# Altium project SDR_PMR.PrjPcb (part 7 of 12)
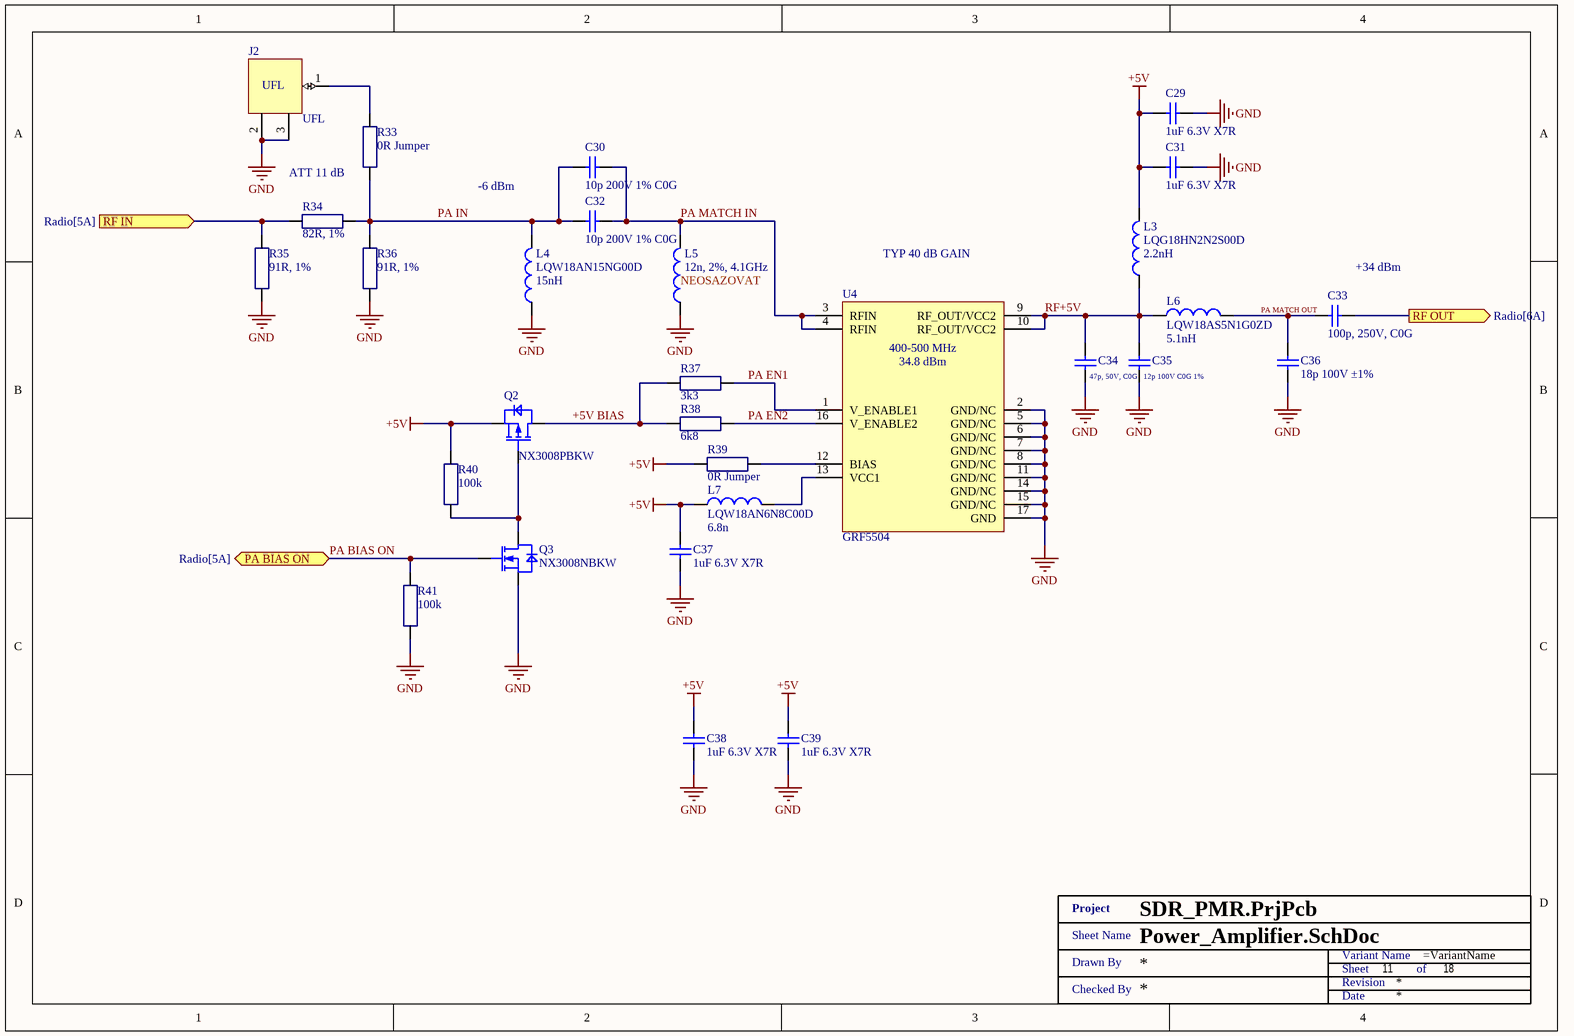
[diagram p18: Power_Amplifier.SchDoc]

## Sheet Power_Amplifier.SchDoc (continued)
### Library data of the parts
C29 C31 C37-C39 = TCC0402X7R105K6R3AT: Capacitor: MLCC; SMD; 0402; 1µF; 6.3V; ±10%; X7R; CCTC; Capacitance: 1u; Supplier 1: LCSC; Supplier Part Number 1: C5448871; Manufacturer: CCTC; Manufacturer Part Number: TCC0402X7R105K6R3AT; Category: Ceramic Capacitors; Stock 1: 242350; Pricing 1: 50=0.0089, 500=0.0072, 1500=0.0063, 10000=0.0058, 20000=0.0053, 50000=0.005 (USD); ComponentLink1URL: https://datasheet.octopart.com:443/TCC0402X7R105K6R3AT-CCTC-datasheet-194166649.pdf?src-supplier=LCSC; ComponentLink1Description: https://datasheet.octopart.com:443/TCC0402X7R105K6R3AT-CCTC-datasheet-194166649.pdf?src-supplier=LCSC; ComponentLink2URL: https://datasheet.octopart.com:443/TCC0402X7R105K6R3AT-CCTC-datasheet-192317456.pdf?src-supplier=HQonline; ComponentLink2Description: https://datasheet.octopart.com:443/TCC0402X7R105K6R3AT-CCTC-datasheet-192317456.pdf?src-supplier=HQonline
C30 C32 = 06032U100FAT2A: Cap Ceramic 10pF 200V C0G 1% Pad SMD 0603 125°C Ultra Low ESR T/R; Manufacturer: Kyocera AVX; Supplier 1: Mouser; Supplier Part Number 1: 581-06032U100FAT2A; Manufacturer Part Number: 06032U100FAT2A; RoHS: Yes; Category: Ceramic Capacitors; Stock 1: 12241; Pricing 1: 1=0.33, 10=0.227, 50=0.227, 100=0.137, 1000=0.087, 10000=0.07 (USD); ComponentLink1URL: https://datasheet.ciiva.com/219/useries-219573.pdf?src-supplier=Digi-Key; ComponentLink1Description: https://datasheet.ciiva.com/219/useries-219573.pdf?src-supplier=Digi-Key; ComponentLink2URL: https://datasheet.ciiva.com/16209/useries-16209209.pdf?src-supplier=Future+Electronics; ComponentLink2Description: https://datasheet.ciiva.com/16209/useries-16209209.pdf?src-supplier=Future+Electronics; Supplier 2: Arrow Electronics; Supplier Part Number 2: 06032U100FAT2A; Supplier 3: Newark; Supplier Part Number 3: 96Y8278; Capacitance: 10p
C33 = 885342006003: CAP CER 100PF 250V C0G/NP0 0603; Manufacturer: Wurth Electronics Inc.; Tolerance: ±5%; Temperature Coefficient: C0G, NP0; Notification: Current market demand for these product types have resulted in fluctuating and extending lead times. Lead times may differ.; Supplier 1: Digi-Key; Supplier Part Number 1: 732-12167-1-ND; Manufacturer Part Number: 885342006003; RoHS: RoHS Compliant; Category: Capacitors; Stock 1: 43; Pricing 1: 1=0.1, 10=0.043, 100=0.0385, 500=0.03406 (USD); Packaging: Cut Tape (CT); Part Status: Active; Voltage - Rated: 250V; Operating Temperature: -55°C ~ 125°C; Features: -; Ratings: -; Applications: General Purpose; Failure Rate: -; Mounting Type: Surface Mount, MLCC; Package / Case: 0603 (1608 Metric); Size / Dimension: 0.063" L x 0.031" W (1.60mm x 0.80mm); Height - Seated (Max): -; Thickness (Max): 0.034" (0.87mm); Lead Spacing: -; Lead Style: -; ComponentLink1URL: https://katalog.we-online.de/pbs/datasheet/885342006003.pdf; ComponentLink1Description: https://katalog.we-online.de/pbs/datasheet/885342006003.pdf; Supplier 2: Farnell; Supplier Part Number 2: 2812519; Supplier 3: Mouser; Supplier Part Number 3: 710-885342006003; Capacitance: 100p
C34 = C0603C470J5GACAUTO: CAP CER 47PF 50V C0G/NP0 0603; Manufacturer: KEMET; Tolerance: ±5%; Temperature Coefficient: C0G, NP0; Manufacturer Part Number: C0603C470J5GACAUTO; RoHS: RoHS Compliant; Category: Capacitors; Stock 1: 21519; Pricing 1: 1=0.12, 10=0.088, 100=0.0391, 500=0.02792, 1000=0.02193 (USD); Packaging: Cut Tape (CT); Part Status: Active; Voltage - Rated: 50V; Operating Temperature: -55°C ~ 125°C; Features: -; Ratings: AEC-Q200; Applications: Automotive; Failure Rate: -; Mounting Type: Surface Mount, MLCC; Package / Case: 0603 (1608 Metric); Size / Dimension: 0.063" L x 0.032" W (1.60mm x 0.80mm); Height - Seated (Max): -; Thickness (Max): 0.034" (0.87mm); Lead Spacing: -; Lead Style: -; ComponentLink1URL: https://search.kemet.com/component-edge/download/datasheet/C0603C470J5GACAUTO.pdf; ComponentLink1Description: https://search.kemet.com/component-edge/download/datasheet/C0603C470J5GACAUTO.pdf; Capacitance: 47p; Supplier 1: Mouser; Supplier Part Number 1: 80-C0603C470J5G; Supplier 2: Farnell; Supplier Part Number 2: 1414639; Supplier 3: Digi-Key; Supplier Part Number 3: 399-6890-1-ND; Supplier 4: TME; Supplier Part Number 4: C0603C470J5GAC
C35 = 06031U120FAT2A: Cap Ceramic 12pF 100V C0G 1% SMD 0603 125°C T/R; Manufacturer: Kyocera AVX; Supplier 1: Mouser; Supplier Part Number 1: 581-06031U120FAT2A; Manufacturer Part Number: 06031U120FAT2A; RoHS: Yes; Category: Ceramic Capacitors; Stock 1: 6418; Pricing 1: 1=0.33, 10=0.227, 50=0.227, 100=0.137, 1000=0.087, 10000=0.07 (USD); Mounting Technology: Surface Mount; Case/Package: 0603; Case Code (Metric): 1608; Case Code (Imperial): 0603; Min Operating Temperature: -55°C; Max Operating Temperature: 125°C; Packaging: Tape and Reel; Capacitance: 12p; Tolerance: 1%; Package Quantity: 4000; Voltage Rating: 100V; Voltage Rating (DC): 100V; Dielectric: C0G; Termination: SMD/SMT; Series: U; Construction: Flat; Length: 1.6mm; Width: 0.81mm; Depth: 0.76mm; Radiation Hardening: No; RoHS Compliant: Yes; ComponentLink1URL: https://datasheet.ciiva.com/208/useries-208490.pdf?src-supplier=Digi-Key; ComponentLink1Description: https://datasheet.ciiva.com/208/useries-208490.pdf?src-supplier=Digi-Key
C36 = 06031U180FAT2A: 0603 18 pF 100 V ±1 % Tolerance C0G/NP0 SMT Multilayer Ceramic Capacitor; Manufacturer: Kyocera AVX; Supplier 1: Mouser; Supplier Part Number 1: 581-06031U180FAT2A; Manufacturer Part Number: 06031U180FAT2A; RoHS: Yes; Category: Ceramic Capacitors; Stock 1: 3660; Pricing 1: 1=0.33, 10=0.227, 50=0.227, 100=0.137, 1000=0.087, 10000=0.07 (USD); ComponentLink1URL: https://datasheet.ciiva.com/11547/useries-11547573.pdf?src-supplier=Avnet; ComponentLink1Description: https://datasheet.ciiva.com/11547/useries-11547573.pdf?src-supplier=Avnet; ComponentLink2URL: https://datasheet.ciiva.com/208/useries-208495.pdf?src-supplier=Digi-Key; ComponentLink2Description: https://datasheet.ciiva.com/208/useries-208495.pdf?src-supplier=Digi-Key; Capacitance: 18p
J2 = CONUFL001-SMD-T: CONN UMC JACK STR SMD; Manufacturer: Linx Technologies Inc.; Connector Style: Ultra Miniature Coaxial; Connector Type: Jack, Male Pin; Supplier 1: Digi-Key; Supplier Part Number 1: CONUFL001-SMD-TCT-ND; Manufacturer Part Number: CONUFL001-SMD-T; RoHS: RoHS Compliant; Category: Connectors, Interconnects; Stock 1: 6423; Pricing 1: 1=0.97, 25=0.882, 100=0.826, 1000=0.742, 2500=0.63 (USD); Packaging: Cut Tape (CT); Part Status: Active; Contact Termination: -; Shield Termination: -; Impedance: -; Mounting Type: Surface Mount; Mounting Feature: -; Cable Group: -; Fastening Type: Snap-On; Features: -; Housing Color: -; Ingress Protection: -; Includes: -; Body Material: -; Body Finish: -; Center Contact Plating: -; Dielectric Material: -; Operating Temperature: -; Center Contact Material: -; Mating Cycles: -; Insertion Loss: -; ComponentLink1URL: http://media.digikey.com/pdf/Data%20Sheets/Linx%20Technologies%20PDFs/CONUFL001-SMD_T_Dwg_RevB_5-15-17.pdf; ComponentLink1Description: http://media.digikey.com/pdf/Data%20Sheets/Linx%20Technologies%20PDFs/CONUFL001-SMD_T_Dwg_RevB_5-15-17.pdf; Supplier 2: Mouser; Supplier Part Number 2: 712-CONUFL001-SMD-T
L3 = LQG18HN2N2S00D: Inductor RF Chip Multi-Layer 2.2nH 0.3nH 100MHz 12Q-Factor Air 500mA 100mOhm DCR 0603 Paper T/R; Manufacturer: Murata; Manufacturer Lifecycle Status: IN PRODUCTION; Current Rating: 1.1A; DC Resistance (DCR): 100mΩ; Number of Circuits: 1; Q Factor: 12; Self Resonant Frequency: 6GHz; Shielding: Unshielded; Tolerance: 13.6364%; Manufacturer Part Number: LQG18HN2N2S00D; RoHS: Compliant; Category: Fixed Inductors; Stock 1: 71049; Pricing 1: 1=0.16, 10=0.133, 50=0.133, 100=0.11, 1000=0.09, 10000=0.068 (USD); Case/Package: 0603; Case Code (Imperial): 0603; Case Code (Metric): 1608; Core Material: Air; Country of Origin: Japan; DC Current: 500mA; Depth: 950µm; Export Control Classification Number (ECCN) Code: EAR99; Height: 800µm; Height - Seated (Max): 939.8µm; Harmonized Tariff Schedule (HTS) Code: 8504.50.80.00; Introduction Date: 2002-01-01; Lead Free: Lead Free; Length: 1.6mm; Lifecycle Status: Production; Max Current Rating: 1.1A; Max DC Current: 500mA; Max Operating Temperature: 85°C; Military Standard: Not; Min Operating Temperature: -40°C; Mounting Technology: Surface Mount; Pins: 2; Number of Terminals: 2; Radiation Hardening: No; REACH SVHC: Yes; RMS Current (Irms): 1.1A; Schedule B: 8504500000, 8504500000|8504500000|8504500000|8504500000|8504500000; ESR: 100mΩ; Termination: SMD/SMT; Test Frequency: 100MHz; Width: 800µm; ComponentLink1URL: https://datasheet.octopart.com:443/LQG18HN2N2S00D-Murata-datasheet-10063984.pdf?src-supplier=_legacy+Avnet; ComponentLink1Description: https://datasheet.octopart.com:443/LQG18HN2N2S00D-Murata-datasheet-10063984.pdf?src-supplier=_legacy+Avnet; ComponentLink2URL: https://datasheet.octopart.com:443/LQG18HN2N2S00D-Murata-datasheet-519214.pdf?src-supplier=_legacy+Avnet; ComponentLink2Description: https://datasheet.octopart.com:443/LQG18HN2N2S00D-Murata-datasheet-519214.pdf?src-supplier=_legacy+Avnet; ComponentLink3URL: https://datasheet.octopart.com:443/LQG18HN2N2S00D-Murata-datasheet-5315143.pdf?src-supplier=element14+APAC; ComponentLink3Description: https://datasheet.octopart.com:443/LQG18HN2N2S00D-Murata-datasheet-5315143.pdf?src-supplier=element14+APAC; ComponentLink4URL: https://datasheet.octopart.com:443/LQG18HN2N2S00D-Murata-datasheet-14393368.pdf?src-supplier=Future+Electronics; ComponentLink4Description: https://datasheet.octopart.com:443/LQG18HN2N2S00D-Murata-datasheet-14393368.pdf?src-supplier=Future+Electronics; ComponentLink5URL: https://datasheet.octopart.com:443/LQG18HN2N2S00D-Murata-datasheet-166148639.pdf?src-supplier=TME; ComponentLink5Description: https://datasheet.octopart.com:443/LQG18HN2N2S00D-Murata-datasheet-166148639.pdf?src-supplier=TME; ComponentLink6URL: https://datasheet.octopart.com:443/LQG18HN2N2S00D-Murata-datasheet-140712951.pdf?src-supplier=Ciiva; ComponentLink6Description: https://datasheet.octopart.com:443/LQG18HN2N2S00D-Murata-datasheet-140712951.pdf?src-supplier=Ciiva; ComponentLink7URL: https://datasheet.octopart.com:443/LQG18HN2N2S00D-Murata-datasheet-138754083.pdf?src-supplier=Ciiva; ComponentLink7Description: https://datasheet.octopart.com:443/LQG18HN2N2S00D-Murata-datasheet-138754083.pdf?src-supplier=Ciiva; ComponentLink8URL: https://datasheet.octopart.com:443/LQG18HN2N2S00D-Murata-datasheet-140568993.pdf?src-supplier=Arrow.cn; ComponentLink8Description: https://datasheet.octopart.com:443/LQG18HN2N2S00D-Murata-datasheet-140568993.pdf?src-supplier=Arrow.cn; ComponentLink9URL: https://datasheet.octopart.com:443/LQG18HN2N2S00D-Murata-datasheet-145449721.pdf?src-supplier=Geoflip; ComponentLink9Description: https://datasheet.octopart.com:443/LQG18HN2N2S00D-Murata-datasheet-145449721.pdf?src-supplier=Geoflip; ComponentLink10URL: https://datasheet.octopart.com:443/LQG18HN2N2S00D-Murata-datasheet-8815610.pdf?src-supplier=Jameco+(USA); ComponentLink10Description: https://datasheet.octopart.com:443/LQG18HN2N2S00D-Murata-datasheet-8815610.pdf?src-supplier=Jameco+(USA); ComponentLink11URL: https://datasheet.octopart.com:443/LQG18HN2N2S00D-Murata-datasheet-331.pdf?src-supplier=DigiKey; ComponentLink11Description: https://datasheet.octopart.com:443/LQG18HN2N2S00D-Murata-datasheet-331.pdf?src-supplier=DigiKey; ComponentLink12URL: http://sigma.octopart.com:80/reach_statement/Murata-company-16.pdf?src-supplier=Compliance+Statements; ComponentLink12Description: http://sigma.octopart.com:80/reach_statement/Murata-company-16.pdf?src-supplier=Compliance+Statements; Supplier 1: Mouser; Supplier Part Number 1: 81-LQG11A2N2S00; Supplier 2: LCSC; Supplier Part Number 2: C113061
L4 = LQW18AN15NG00D: Inductor RF Chip Wirewound 15nH 2% 100MHz 40Q-Factor 600mA 130mOhm DCR 0603 Paper T/R; Manufacturer: Murata; Manufacturer Lifecycle Status: IN PRODUCTION; Core Material: Air; Current: 440mA; DC Resistance (DCR): 130mΩ; Number of Circuits: 1; Q Factor: 40; Self Resonant Frequency: 6GHz; Shielding: Unshielded; Test Frequency: 250MHz; Manufacturer Part Number: LQW18AN15NG00D; RoHS: Compliant; Category: Fixed Inductors; Pricing 1: 1=0.14, 10=0.126, 50=0.116, 100=0.092, 1000=0.072, 10000=0.052 (USD); Case/Package: 0603; Case Code (Imperial): 0603; Case Code (Metric): 1608; Composition: Wirewound; Country of Origin: Japan; Current Rating: 600mA; DC Current: 600mA; Depth: 1mm; Export Control Classification Number (ECCN) Code: EAR99; Height: 800µm; Harmonized Tariff Schedule (HTS) Code: 8504.50.80.00; Inductance Tolerance: 2%; Introduction Date: 2002-03-28; Lead Free: Lead Free; Length: 1.6mm; Lifecycle Status: Production; Max Current Rating: 600mA; Max DC Current: 600mA; Max Operating Temperature: 125°C; Military Standard: Not; Min Operating Temperature: -55°C; Mounting Technology: Surface Mount; Pins: 2; Number of Terminals: 2; Packaging: Cut Tape; Radiation Hardening: No; REACH SVHC: Yes; RMS Current (Irms): 600mA; Schedule B: 8504500000, 8504500000|8504500000|8504500000|8504500000|8504500000; ESR: 130mΩ; Termination: SMD/SMT; Tolerance: 2%; Weight: 3.005049mg; Width: 800µm; ComponentLink1URL: https://datasheet.octopart.com:443/LQW18AN15NG00D-Murata-datasheet-11553032.pdf?src-supplier=element14+APAC; ComponentLink1Description: https://datasheet.octopart.com:443/LQW18AN15NG00D-Murata-datasheet-11553032.pdf?src-supplier=element14+APAC; ComponentLink2URL: https://datasheet.octopart.com:443/LQW18AN15NG00D-Murata-datasheet-518094.pdf?src-supplier=element14+APAC; ComponentLink2Description: https://datasheet.octopart.com:443/LQW18AN15NG00D-Murata-datasheet-518094.pdf?src-supplier=element14+APAC; ComponentLink3URL: https://datasheet.octopart.com:443/LQW18AN15NG00D-Murata-datasheet-145452279.pdf?src-supplier=Geoflip; ComponentLink3Description: https://datasheet.octopart.com:443/LQW18AN15NG00D-Murata-datasheet-145452279.pdf?src-supplier=Geoflip; ComponentLink4URL: https://datasheet.octopart.com:443/LQW18AN15NG00D-Murata-datasheet-141294525.pdf?src-supplier=Ciiva; ComponentLink4Description: https://datasheet.octopart.com:443/LQW18AN15NG00D-Murata-datasheet-141294525.pdf?src-supplier=Ciiva; ComponentLink5URL: https://datasheet.octopart.com:443/LQW18AN15NG00D-Murata-datasheet-140717709.pdf?src-supplier=Ciiva; ComponentLink5Description: https://datasheet.octopart.com:443/LQW18AN15NG00D-Murata-datasheet-140717709.pdf?src-supplier=Ciiva; ComponentLink6URL: https://datasheet.octopart.com:443/LQW18AN15NG00D-Murata-datasheet-138758738.pdf?src-supplier=Ciiva; ComponentLink6Description: https://datasheet.octopart.com:443/LQW18AN15NG00D-Murata-datasheet-138758738.pdf?src-supplier=Ciiva; ComponentLink7URL: https://datasheet.octopart.com:443/LQW18AN15NG00D-Murata-datasheet-140569672.pdf?src-supplier=Arrow.cn; ComponentLink7Description: https://datasheet.octopart.com:443/LQW18AN15NG00D-Murata-datasheet-140569672.pdf?src-supplier=Arrow.cn; ComponentLink8URL: https://datasheet.octopart.com:443/LQW18AN15NG00D-Murata-datasheet-67271391.pdf?src-supplier=TME; ComponentLink8Description: https://datasheet.octopart.com:443/LQW18AN15NG00D-Murata-datasheet-67271391.pdf?src-supplier=TME; ComponentLink9URL: https://datasheet.octopart.com:443/LQW18AN15NG00D-Murata-datasheet-117639981.pdf?src-supplier=TME; ComponentLink9Description: https://datasheet.octopart.com:443/LQW18AN15NG00D-Murata-datasheet-117639981.pdf?src-supplier=TME; ComponentLink10URL: https://datasheet.octopart.com:443/LQW18AN15NG00D-Murata-datasheet-14066793.pdf?src-supplier=iiiC; ComponentLink10Description: https://datasheet.octopart.com:443/LQW18AN15NG00D-Murata-datasheet-14066793.pdf?src-supplier=iiiC; ComponentLink11URL: https://datasheet.octopart.com/LQW18AN15NG00D-Murata-datasheet-14392282.pdf; ComponentLink11Description: https://datasheet.octopart.com/LQW18AN15NG00D-Murata-datasheet-14392282.pdf; ComponentLink12URL: https://datasheet.octopart.com:443/LQW18AN15NG00D-Murata-datasheet-44661258.pdf?src-supplier=Future+Electronics; ComponentLink12Description: https://datasheet.octopart.com:443/LQW18AN15NG00D-Murata-datasheet-44661258.pdf?src-supplier=Future+Electronics; ComponentLink13URL: http://sigma.octopart.com:80/reach_statement/Murata-company-16.pdf?src-supplier=Compliance+Statements; ComponentLink13Description: http://sigma.octopart.com:80/reach_statement/Murata-company-16.pdf?src-supplier=Compliance+Statements; Supplier 1: Mouser; Supplier Part Number 1: 81-LQW18AN15NG00D; Supplier 2: LCSC; Supplier Part Number 2: C86132
L5 = 0603HP-12NXGLU: Fixed Inductors 0603HP Hi Perfrmnce 12 nH 2 % 1.1 A; Manufacturer: Coilcraft; Core Material: Ceramic; Q Factor: 91; Max DC Current: 1.1A; DC Resistance (DCR): 88mR; Test Frequency: 250MHz; Supplier 1: Mouser; Supplier Part Number 1: 994-0603HP-12NXGLU; Manufacturer Part Number: 0603HP-12NXGLU; Stock 1: 1052; Pricing 1: 1=1.18000, 10=1.18000, 50=1.18000, 100=1.18000, 200=0.89000, 500=0.66000, 1000=0.44000, 2000=0.40500 (USD); RoHS: Yes; Mount: Surface Mount; Case/Package: 0603; Case Code (Metric): 1608; Case Code (Imperial): 0603; Min Operating Temperature: -40°C; Max Operating Temperature: 125°C; Packaging: Cut Tape; Tolerance: 2%; Inductance: 12n; Self Resonant Frequency: 4.1GHz; Termination: SMD/SMT; Inductance Tolerance: 2%; Current Rating: 1.1A; Length: 1.75mm; Height: 0.94mm; Width: 1.09mm; Lead Free: Contains Lead; REACH SVHC: No SVHC; ComponentLink1URL: https://datasheet.ciiva.com/13167/0603hp-13167775.pdf?src-supplier=Mouser; ComponentLink1Description: https://datasheet.ciiva.com/13167/0603hp-13167775.pdf?src-supplier=Mouser; ComponentLink2URL: https://datasheet.ciiva.com/22680/1681881-22680847.pdf?src-supplier=Element14; ComponentLink2Description: https://datasheet.ciiva.com/22680/1681881-22680847.pdf?src-supplier=Element14; Supplier 2: Farnell; Supplier Part Number 2: 2286146
L6 = LQW18AS5N1G0ZD: General Purpose Inductor, 0.0051uH, 2%, 1 Element, Wirewound-Core, Reflow soldering, 1608/0603; Manufacturer: Murata; Manufacturer Lifecycle Status: IN PRODUCTION; Core Material: Non-Magnetic; Current Rating: 700mA; DC Resistance (DCR): 140mΩ; Number of Circuits: 1; Q Factor: 20; Self Resonant Frequency: 5.7GHz; Shielding: Unshielded; Test Frequency: 250MHz; Manufacturer Part Number: LQW18AS5N1G0ZD; RoHS: Compliant; Category: Fixed Inductors; Stock 1: 386; Pricing 1: 1=0.16, 10=0.128, 50=0.112, 100=0.106, 1000=0.087, 10000=0.069 (USD); Case/Package: 0603; Composition: Wirewound; Height: 800µm; Length: 1.6mm; Lifecycle Status: Production; Max Current Rating: 700mA; Max Operating Temperature: 125°C; Min Operating Temperature: -40°C; Number of Terminals: 2; Ratings: AEC-Q200; REACH SVHC: Yes; RMS Current (Irms): 700mA; Schedule B: 8504500000, 8504500000|8504500000, 8504500000|8504500000|8504500000, 8504500000|8504500000|8504500000|8504500000; ESR: 140mΩ; Tolerance: 2%; Width: 800µm; ComponentLink1URL: https://datasheet.octopart.com:443/LQW18AS5N1G0ZD-Murata-datasheet-142543410.pdf?src-supplier=Ciiva; ComponentLink1Description: https://datasheet.octopart.com:443/LQW18AS5N1G0ZD-Murata-datasheet-142543410.pdf?src-supplier=Ciiva; ComponentLink2URL: https://datasheet.octopart.com:443/LQW18AS5N1G0ZD-Murata-datasheet-141294536.pdf?src-supplier=Ciiva; ComponentLink2Description: https://datasheet.octopart.com:443/LQW18AS5N1G0ZD-Murata-datasheet-141294536.pdf?src-supplier=Ciiva; ComponentLink3URL: https://datasheet.octopart.com:443/LQW18AS5N1G0ZD-Murata-datasheet-140718349.pdf?src-supplier=Ciiva; ComponentLink3Description: https://datasheet.octopart.com:443/LQW18AS5N1G0ZD-Murata-datasheet-140718349.pdf?src-supplier=Ciiva; ComponentLink4URL: https://datasheet.octopart.com:443/LQW18AS5N1G0ZD-Murata-datasheet-138759371.pdf?src-supplier=Ciiva; ComponentLink4Description: https://datasheet.octopart.com:443/LQW18AS5N1G0ZD-Murata-datasheet-138759371.pdf?src-supplier=Ciiva; ComponentLink5URL: https://datasheet.octopart.com:443/LQW18AS5N1G0ZD-Murata-datasheet-145452409.pdf?src-supplier=Geoflip; ComponentLink5Description: https://datasheet.octopart.com:443/LQW18AS5N1G0ZD-Murata-datasheet-145452409.pdf?src-supplier=Geoflip; ComponentLink6URL: https://datasheet.octopart.com:443/LQW18AS5N1G0ZD-Murata-datasheet-140569745.pdf?src-supplier=Arrow.cn; ComponentLink6Description: https://datasheet.octopart.com:443/LQW18AS5N1G0ZD-Murata-datasheet-140569745.pdf?src-supplier=Arrow.cn; ComponentLink7URL: http://sigma.octopart.com:80/reach_statement/Murata-company-16.pdf?src-supplier=Compliance+Statements; ComponentLink7Description: http://sigma.octopart.com:80/reach_statement/Murata-company-16.pdf?src-supplier=Compliance+Statements; Supplier 1: Mouser; Supplier Part Number 1: 81-LQW18AS5N1G0ZD; Supplier 2: LCSC; Supplier Part Number 2: C2043783
L7 = LQW18AN6N8C00D: Inductor RF Chip Wirewound 6.8nH 0.2nH 100MHz 35Q-Factor 750mA 82mOhm DCR 0603 Paper T/R; Manufacturer: Murata; Manufacturer Lifecycle Status: IN PRODUCTION; Core Material: Air; Current: 180mA; DC Resistance (DCR): 82mΩ; Number of Circuits: 1; Q Factor: 35; Self Resonant Frequency: 6GHz; Shielding: Unshielded; Test Frequency: 250MHz; Tolerance: 2.94%; Manufacturer Part Number: LQW18AN6N8C00D; RoHS: Compliant; Category: Fixed Inductors; Stock 1: 8537; Pricing 1: 1=0.12, 10=0.099, 50=0.099, 100=0.081, 1000=0.067, 10000=0.053 (USD); Case/Package: 0603; Case Code (Imperial): 0603; Case Code (Metric): 1608; Composition: Wirewound; Country of Origin: Japan; Current Rating: 750mA; DC Current: 750mA; Depth: 1mm; Export Control Classification Number (ECCN) Code: EAR99; Height: 800µm; Height - Seated (Max): 990.6µm; Harmonized Tariff Schedule (HTS) Code: 8504.50.80.00; Introduction Date: 2002-03-28; Lead Free: Lead Free; Length: 1.6mm; Lifecycle Status: Production; Max Current Rating: 750mA; Max DC Current: 750mA; Max Operating Temperature: 125°C; Military Standard: Not; Min Operating Temperature: -55°C; Mounting Technology: Surface Mount; Number of Terminals: 2; Packaging: Tape & Reel (TR); REACH SVHC: Yes; RMS Current (Irms): 750mA; Schedule B: 8504500000, 8504500000|8504500000|8504500000|8504500000|8504500000; ESR: 82mΩ; Termination: SMD/SMT; Weight: 3.005049mg; Width: 800µm; ComponentLink1URL: https://datasheet.octopart.com:443/LQW18AN6N8C00D-Murata-datasheet-11553032.pdf?src-supplier=element14+APAC; ComponentLink1Description: https://datasheet.octopart.com:443/LQW18AN6N8C00D-Murata-datasheet-11553032.pdf?src-supplier=element14+APAC; ComponentLink2URL: https://datasheet.octopart.com:443/LQW18AN6N8C00D-Murata-datasheet-518094.pdf?src-supplier=_legacy+Avnet; ComponentLink2Description: https://datasheet.octopart.com:443/LQW18AN6N8C00D-Murata-datasheet-518094.pdf?src-supplier=_legacy+Avnet; ComponentLink3URL: https://datasheet.octopart.com:443/LQW18AN6N8C00D-Murata-datasheet-145452279.pdf?src-supplier=Geoflip; ComponentLink3Description: https://datasheet.octopart.com:443/LQW18AN6N8C00D-Murata-datasheet-145452279.pdf?src-supplier=Geoflip; ComponentLink4URL: https://datasheet.octopart.com:443/LQW18AN6N8C00D-Murata-datasheet-141294533.pdf?src-supplier=Ciiva; ComponentLink4Description: https://datasheet.octopart.com:443/LQW18AN6N8C00D-Murata-datasheet-141294533.pdf?src-supplier=Ciiva; ComponentLink5URL: https://datasheet.octopart.com:443/LQW18AN6N8C00D-Murata-datasheet-140718000.pdf?src-supplier=Ciiva; ComponentLink5Description: https://datasheet.octopart.com:443/LQW18AN6N8C00D-Murata-datasheet-140718000.pdf?src-supplier=Ciiva; ComponentLink6URL: https://datasheet.octopart.com:443/LQW18AN6N8C00D-Murata-datasheet-138759027.pdf?src-supplier=Ciiva; ComponentLink6Description: https://datasheet.octopart.com:443/LQW18AN6N8C00D-Murata-datasheet-138759027.pdf?src-supplier=Ciiva; ComponentLink7URL: https://datasheet.octopart.com:443/LQW18AN6N8C00D-Murata-datasheet-142046225.pdf?src-supplier=Arrow.cn; ComponentLink7Description: https://datasheet.octopart.com:443/LQW18AN6N8C00D-Murata-datasheet-142046225.pdf?src-supplier=Arrow.cn; ComponentLink8URL: https://datasheet.octopart.com:443/LQW18AN6N8C00D-Murata-datasheet-67271403.pdf?src-supplier=TME; ComponentLink8Description: https://datasheet.octopart.com:443/LQW18AN6N8C00D-Murata-datasheet-67271403.pdf?src-supplier=TME; ComponentLink9URL: https://datasheet.octopart.com:443/LQW18AN6N8C00D-Murata-datasheet-117639981.pdf?src-supplier=TME; ComponentLink9Description: https://datasheet.octopart.com:443/LQW18AN6N8C00D-Murata-datasheet-117639981.pdf?src-supplier=TME; ComponentLink10URL: https://datasheet.octopart.com:443/LQW18AN6N8C00D-Murata-datasheet-34141935.pdf?src-supplier=Megastar; ComponentLink10Description: https://datasheet.octopart.com:443/LQW18AN6N8C00D-Murata-datasheet-34141935.pdf?src-supplier=Megastar; ComponentLink11URL: https://datasheet.octopart.com:443/LQW18AN6N8C00D-Murata-datasheet-14066793.pdf?src-supplier=iiiC; ComponentLink11Description: https://datasheet.octopart.com:443/LQW18AN6N8C00D-Murata-datasheet-14066793.pdf?src-supplier=iiiC; ComponentLink12URL: https://datasheet.octopart.com/LQW18AN6N8C00D-Murata-datasheet-14392314.pdf; ComponentLink12Description: https://datasheet.octopart.com/LQW18AN6N8C00D-Murata-datasheet-14392314.pdf; ComponentLink13URL: https://datasheet.octopart.com:443/LQW18AN6N8C00D-Murata-datasheet-44661396.pdf?src-supplier=Future+Electronics; ComponentLink13Description: https://datasheet.octopart.com:443/LQW18AN6N8C00D-Murata-datasheet-44661396.pdf?src-supplier=Future+Electronics; ComponentLink14URL: http://sigma.octopart.com:80/reach_statement/Murata-company-16.pdf?src-supplier=Compliance+Statements; ComponentLink14Description: http://sigma.octopart.com:80/reach_statement/Murata-company-16.pdf?src-supplier=Compliance+Statements; Supplier 1: Mouser; Supplier Part Number 1: 81-LQW18AN6N8C00D; Supplier 2: LCSC; Supplier Part Number 2: C86136
Q2 = NX3008PBKW: NXP - NX3008PBKW - MOSFET, P CH, 30V, 200MA, SOT323; Transistor Polarity: P Channel; Continuous Drain Current Id: -200; Drain Source Voltage Vds: -30; On Resistance Rds(on): 2.8; Rds(on) Test Voltage Vgs: -4.5; Threshold Voltage Vgs: -900; Power Dissipation Pd: 260; Transistor Case Style: SOT-323; No. of Pins: 3; SVHC: No SVHC (17-Dec-2015); Pulse Current Idm: -0.8; Voltage Vgs th Max: 8V<!--FANDB--><div class="features-and-benefits-container"><div class="features-and-benefits-description"><span class="features-benefits-value">The NX3008PBKW is a P-channel enhancement mode Field-Effect Transistor (FET) in surface mount plastic package using Trench MOSFET technology. Suitable for relay driver, high-speed line driver and high-side loadswitch.</span></div><div class="features-and-benefits-list"><ul class="features-and-benefits-list-list"><li class="features-and-benefits-list-item">Logic-level compatible</li><li class="features-and-benefits-list-item">Very fast switching</li><li class="features-and-benefits-list-item">AEC-Q101 Qualified</li><li class="features-and-benefits-list-item">Up to 1; Supplier 1: Farnell; Supplier Part Number 1: 2069551; Manufacturer: NXP; Manufacturer Part Number: NX3008PBKW; RoHS: YES; Stock 1: 18626; Pricing 1: 1=0.037, 25=0.0347, 100=0.0323, 250=0.03, 500=0.0294, 2000=0.0288, 4000=0.0282, 20000=0.0276 (GBP); Operating Temperature Max: 150; Product Range: -; Automotive Qualification Standard: -; MSL: MSL 1 - Unlimited; Operating Temperature Min: -55; Operating Temperature Range: -55°C to +150; ComponentLink1URL: http://www.farnell.com/datasheets/1508398.pdf; ComponentLink1Description: http://www.farnell.com/datasheets/1508398.pdf; Supplier 2: Digi-Key; Supplier Part Number 2: 568-10503-1-ND
Q3 = NX3008NBKW: NXP - NX3008NBKW - MOSFET, N CH, 30V, 350MA, SOT323; Transistor Polarity: N Channel; Continuous Drain Current Id: 350; Drain Source Voltage Vds: 30; On Resistance Rds(on): 1; Rds(on) Test Voltage Vgs: 4.5; Threshold Voltage Vgs: 900; Power Dissipation Pd: 260; Transistor Case Style: SOT-323; No. of Pins: 3; SVHC: No SVHC (17-Dec-2015); Pulse Current Idm: -0.8; Voltage Vgs th Max: 8; Manufacturer: NXP; Manufacturer Part Number: NX3008NBKW; RoHS: YES; Stock 1: 4764; Pricing 1: 1=0.0425, 25=0.0385, 100=0.0347, 250=0.0334, 500=0.0312, 2000=0.0291, 4000=0.0282, 20000=0.0273 (GBP); Operating Temperature Max: 150; Product Range: -; Automotive Qualification Standard: -; MSL: MSL 1 - Unlimited; Operating Temperature Min: -55; Operating Temperature Range: -55°C to +150; ComponentLink1URL: http://www.farnell.com/datasheets/1508392.pdf; ComponentLink1Description: http://www.farnell.com/datasheets/1508392.pdf; Supplier 1: Mouser; Supplier Part Number 1: 771-NX3008NBKW,115; Supplier 2: Farnell; Supplier Part Number 2: 2069546; Supplier 3: Arrow; Supplier Part Number 3: NX3008NBKW,115
R33 R39 = HQ02WAF0000TCE: Resistor: thick film / jumper; SMD; 0402; 0Ω; 100mW; max 50V; -55÷155°C; UNI-ROYAL; Manufacturer: Uniroyal; Supplier 1: LCSC; Supplier Part Number 1: C2791314; Manufacturer Part Number: HQ02WAF0000TCE; Category: Uncategorized; Stock 1: 5900; Pricing 1: 100=0.0059, 1000=0.0051, 3000=0.0047, 10000=0.0045, 50000=0.0043 (USD); ComponentLink1URL: https://datasheet.octopart.com:443/HQ02WAF0000TCE-Uniroyal-datasheet-194224146.pdf?src-supplier=LCSC; ComponentLink1Description: https://datasheet.octopart.com:443/HQ02WAF0000TCE-Uniroyal-datasheet-194224146.pdf?src-supplier=LCSC; Resistance: 0R
R34 = WR06X82R0FTL: WALSIN - WR06X82R0FTL - RESISTOR, THICK FILM, 82R, 1%, 75V, 0603; Voltage Rating: 75; Resistor Case Style: 0603 [1608 Metric]; Power Rating: 100; Product Range: WR06 Series; Temperature Coefficient: ± 100; Supplier 1: Farnell; Supplier Part Number 1: 2502484; Manufacturer: WALSIN; Manufacturer Part Number: WR06X82R0FTL; RoHS: YES; Stock 1: 1700; Pricing 1: 10=0.0128, 100=0.0043, 500=0.0026, 1000=0.0018, 2500=0.0014 (GBP); Resistance: 82R; Resistance Tolerance: ± 1%; Packaging: Cut Tape; Resistor Element Material: Thick Film; Automotive Qualification Standard: -; MSL: MSL 2 - 1 year<!--FANDB--><div class="features-and-benefits-container"><div class="features-and-benefits-desc-container"><span class="features-and-benefits-container-desc">SMD Chip Resistor, 82 ohm, 75 V, 0603 [1608 Metric], 100 mW, ± 1%, WR06 Series</span></div><div class="features-and-benefits-description"><span class="features-benefits-value">The WR06 series resistors from Walsin are general purpose thick film chip resistors. These resistors are constructed in a high grade ceramic body (aluminium oxide).</span></div><div class="features-and-benefits-list"><ul class="features-and-benefits-list-list"><li class="features-and-benefits-list-item">Resistance range includes E24 and E96 decade values from 1ohm to 10Mohm</li><li class="features-and-benefits-list-item">EIA 0603 case size</li><li class="features-and-benefits-list-item">Available in ?±100ppm/°C and -200ppm/°C to +400ppm/°C TCR values</li><li class="features-and-benefits-list-item">Available in ±1% and ±5% tolerance</li><li class="features-and-benefits-list-item">High reliability and stability</li><li class="features-and-benefits-list-item">Higher component and equipment reliability</li><li class="features-and-benefits-list-item">Lower assembly costs</li><li class="features-and-benefits-list-item">Reduced size of final equipment</li><li class="features-and-benefits-list-item">Continuous working voltage is 75V and rated power is 100; ComponentLink1URL: http://www.farnell.com/datasheets/1960319.pdf; ComponentLink1Description: http://www.farnell.com/datasheets/1960319.pdf
R35 R36 = RC0603FR-0791RL: SMD Chip Resistor, 91 Ohm, ± 1%, 100 mW, 0603 [1608 Metric], Thick Film, General Purpose; Manufacturer: Yageo; Power Rating: 100mW; Voltage Rating: 50V; Temperature Coefficient: 100ppm/°C; Supplier 1: Mouser; Supplier Part Number 1: 603-RC0603FR-0791RL; Manufacturer Part Number: RC0603FR-0791RL; RoHS: Yes; Category: Chip SMD Resistors; Stock 1: 58719; Pricing 1: 1=0.1, 10=0.011, 50=0.011, 100=0.006, 1000=0.004, 10000=0.004 (USD); Case/Package: 0603; Case Code (Imperial): 0603; Case Code (Metric): 1608; Min Operating Temperature: -55°C; Max Operating Temperature: 155°C; Packaging: Tape and Reel; Resistance: 91R; Tolerance: 1%; Termination: SMD/SMT; Number of Terminations: 2; Max Power Dissipation: 100mW; Features: Moisture Resistant; Series: RC; Construction: Rectangular; Voltage Rating (DC): 50V; Length: 1.6mm; Width: 0.8mm; Height: 0.45mm; Depth: 0.8mm; Military Standard: Not; RoHS Compliant: Yes; Lead Free: 5697LeadFree; ComponentLink1URL: https://datasheet.ciiva.com/2455/pyu-r-int-thick-7-2455336.pdf?src-supplier=Digi-Key; ComponentLink1Description: https://datasheet.ciiva.com/2455/pyu-r-int-thick-7-2455336.pdf?src-supplier=Digi-Key; ComponentLink2URL: https://datasheet.ciiva.com/2455/pyu-r-int-thick-7-2455337.pdf?src-supplier=Digi-Key; ComponentLink2Description: https://datasheet.ciiva.com/2455/pyu-r-int-thick-7-2455337.pdf?src-supplier=Digi-Key; ComponentLink3URL: https://datasheet.ciiva.com/2455/pyu-r-int-thick-7-2455335.pdf?src-supplier=Digi-Key; ComponentLink3Description: https://datasheet.ciiva.com/2455/pyu-r-int-thick-7-2455335.pdf?src-supplier=Digi-Key; Supplier 2: Farnell; Supplier Part Number 2: 3950881; Supplier 3: Digi-Key; Supplier Part Number 3: 311-91.0HRCT-ND
R37 = RC0402FR-073K3L: 62.5Mw Thick Film Resistors 100Ppm/ 1% 3.3K 0402 Chip Resistor Surface Mount Rohs; Manufacturer: Yageo Group; Max Power Dissipation: 63mW; Temperature Coefficient: 100ppm/°C; Voltage Rating: 50V; Supplier 1: Mouser; Supplier Part Number 1: 603-RC0402FR-073K3L; Manufacturer Part Number: RC0402FR-073K3L; RoHS: Compliant; Category: Chip SMD Resistors; Stock 1: 519298; Pricing 1: 1=0.1, 10=0.011, 50=0.011, 100=0.007, 1000=0.006, 10000=0.002 (USD); Case/Package: 0402; Case Code (Imperial): 0402; Case Code (Metric): 0402; China RoHS: Non-Compliant; Composition: Thick Film; Country of Origin: Mainland China, Taiwan; Depth: 500µm; Export Control Classification Number (ECCN) Code: EAR99; Features: Moisture Resistant; Height: 350µm; Harmonized Tariff Schedule (HTS) Code: 8533.21.00.30; Introduction Date: 2008-07-18; Lead Free: Lead Free; Length: 1mm; Lifecycle Status: Production; Max Operating Temperature: 155°C; Military Standard: Not; Min Operating Temperature: -55°C; Mounting Technology: Surface Mount; Pins: 2; Number of Terminals: 2; Number of Terminations: 2; Packaging: Tape & Reel; Power Rating: 62.5mW; REACH SVHC: Yes; Resistance: 3k3; Schedule B: 8533210045, 8533210045|8533210045, 8533210045|8533210045|8533210045, 8533210045|8533210045|8533210045|8533210045; Termination: SMD/SMT; Tolerance: 1%; Voltage Rating (AC): 50V; Voltage Rating (DC): 50V; Width: 500µm; Working Voltage: 50V; ComponentLink1URL: https://datasheet.octopart.com:443/RC0402FR-073K3L-Yageo-datasheet-175887523.pdf?src-supplier=IHS; ComponentLink1Description: https://datasheet.octopart.com:443/RC0402FR-073K3L-Yageo-datasheet-175887523.pdf?src-supplier=IHS; ComponentLink2URL: https://datasheet.octopart.com:443/RC0402FR-073K3L-Yageo-datasheet-103092701.pdf?src-supplier=Upverter; ComponentLink2Description: https://datasheet.octopart.com:443/RC0402FR-073K3L-Yageo-datasheet-103092701.pdf?src-supplier=Upverter; ComponentLink3URL: https://datasheet.octopart.com:443/RC0402FR-073K3L-Yageo-datasheet-98239111.pdf?src-supplier=Upverter; ComponentLink3Description: https://datasheet.octopart.com:443/RC0402FR-073K3L-Yageo-datasheet-98239111.pdf?src-supplier=Upverter; ComponentLink4URL: https://datasheet.octopart.com:443/RC0402FR-073K3L-Yageo-Group-datasheet-190305687.pdf?src-supplier=Newark; ComponentLink4Description: https://datasheet.octopart.com:443/RC0402FR-073K3L-Yageo-Group-datasheet-190305687.pdf?src-supplier=Newark; ComponentLink5URL: https://datasheet.octopart.com:443/RC0402FR-073K3L-Yageo-datasheet-10408619.pdf?src-supplier=Newark; ComponentLink5Description: https://datasheet.octopart.com:443/RC0402FR-073K3L-Yageo-datasheet-10408619.pdf?src-supplier=Newark; ComponentLink6URL: https://datasheet.octopart.com:443/RC0402FR-073K3L-Yageo-datasheet-8324527.pdf?src-supplier=TME; ComponentLink6Description: https://datasheet.octopart.com:443/RC0402FR-073K3L-Yageo-datasheet-8324527.pdf?src-supplier=TME; ComponentLink7URL: https://datasheet.octopart.com:443/RC0402FR-073K3L-Yageo-datasheet-62067350.pdf?src-supplier=Farnell; ComponentLink7Description: https://datasheet.octopart.com:443/RC0402FR-073K3L-Yageo-datasheet-62067350.pdf?src-supplier=Farnell; ComponentLink8URL: https://datasheet.octopart.com:443/RC0402FR-073K3L-Yageo-datasheet-13691069.pdf?src-supplier=Farnell; ComponentLink8Description: https://datasheet.octopart.com:443/RC0402FR-073K3L-Yageo-datasheet-13691069.pdf?src-supplier=Farnell; ComponentLink9URL: https://datasheet.octopart.com:443/RC0402FR-073K3L-Yageo-datasheet-8329306.pdf?src-supplier=element14; ComponentLink9Description: https://datasheet.octopart.com:443/RC0402FR-073K3L-Yageo-datasheet-8329306.pdf?src-supplier=element14; ComponentLink10URL: https://datasheet.octopart.com:443/RC0402FR-073K3L-Yageo-Group-datasheet-176638170.pdf?src-supplier=Future+Electronics; ComponentLink10Description: https://datasheet.octopart.com:443/RC0402FR-073K3L-Yageo-Group-datasheet-176638170.pdf?src-supplier=Future+Electronics; ComponentLink11URL: https://datasheet.octopart.com:443/RC0402FR-073K3L-Yageo-datasheet-164759695.pdf?src-supplier=Future+Electronics; ComponentLink11Description: https://datasheet.octopart.com:443/RC0402FR-073K3L-Yageo-datasheet-164759695.pdf?src-supplier=Future+Electronics; ComponentLink12URL: https://datasheet.octopart.com:443/RC0402FR-073K3L-Yageo-datasheet-137700087.pdf?src-supplier=Future+Electronics; ComponentLink12Description: https://datasheet.octopart.com:443/RC0402FR-073K3L-Yageo-datasheet-137700087.pdf?src-supplier=Future+Electronics; ComponentLink13URL: https://datasheet.octopart.com:443/RC0402FR-073K3L-Yageo-datasheet-12531192.pdf?src-supplier=Future+Electronics; ComponentLink13Description: https://datasheet.octopart.com:443/RC0402FR-073K3L-Yageo-datasheet-12531192.pdf?src-supplier=Future+Electronics; ComponentLink14URL: https://datasheet.octopart.com:443/RC0402FR-073K3L-Yageo-datasheet-505231.pdf?src-supplier=Future+Electronics; ComponentLink14Description: https://datasheet.octopart.com:443/RC0402FR-073K3L-Yageo-datasheet-505231.pdf?src-supplier=Future+Electronics; ComponentLink15URL: https://datasheet.octopart.com:443/RC0402FR-073K3L-Yageo-datasheet-175423674.pdf?src-supplier=SOS+electronic; ComponentLink15Description: https://datasheet.octopart.com:443/RC0402FR-073K3L-Yageo-datasheet-175423674.pdf?src-supplier=SOS+electronic; ComponentLink16URL: https://datasheet.octopart.com/RC0402FR-073K3L-Yageo-datasheet-73766026.pdf; ComponentLink16Description: https://datasheet.octopart.com/RC0402FR-073K3L-Yageo-datasheet-73766026.pdf; ComponentLink17URL: http://sigma.octopart.com:80/conflict_mineral_statement/Yageo-company-3.pdf?src-supplier=Compliance+Statements; ComponentLink17Description: http://sigma.octopart.com:80/conflict_mineral_statement/Yageo-company-3.pdf?src-supplier=Compliance+Statements; ComponentLink18URL: http://sigma.octopart.com:80/rohs_statement/Yageo-company-2.pdf?src-supplier=Compliance+Statements; ComponentLink18Description: http://sigma.octopart.com:80/rohs_statement/Yageo-company-2.pdf?src-supplier=Compliance+Statements; Supplier 2: LCSC; Supplier Part Number 2: C137992
R38 = RC0402FR-076K8L: 62.5mW Thick Film Resistors 50V ±100ppm/℃ ±1% 6.8kΩ 0402 Chip Resistor - Surface Mount ROHS; Manufacturer: Yageo Group; Max Power Dissipation: 63mW; Temperature Coefficient: 100ppm/°C; Supplier 1: Mouser; Supplier Part Number 1: 603-RC0402FR-076K8L; Manufacturer Part Number: RC0402FR-076K8L; RoHS: Compliant; Category: Chip SMD Resistors; Stock 1: 151780; Pricing 1: 1=0.1, 10=0.011, 50=0.011, 100=0.006, 1000=0.006, 10000=0.002 (USD); Case/Package: 0402; Case Code (Imperial): 0402; China RoHS: Non-Compliant; Composition: Thick Film; Country of Origin: Mainland China, Taiwan; Depth: 500µm; Export Control Classification Number (ECCN) Code: EAR99; Features: Moisture Resistant; Height: 350µm; Harmonized Tariff Schedule (HTS) Code: 8533.21.00.30; Introduction Date: 2008-07-18; Lead Free: Lead Free; Length: 1mm; Lifecycle Status: Production; Max Operating Temperature: 155°C; Military Standard: Not; Min Operating Temperature: -55°C; Mounting Technology: Surface Mount; Pins: 2; Number of Terminals: 2; Number of Terminations: 2; Packaging: Tape & Reel; Power Rating: 62.5mW; REACH SVHC: Yes; Value: 6k8; Schedule B: 8533210045, 8533210045|8533210045|8533210045|8533210045|8533210045|8533210045|8533210045|8533210045|8533210045|8533210045|8533210045|8533210045|8533210045|8533210045|8533210045|8533210045|8533210045|8533210045|8533210045|8533210045|8533210045|8533210045|8533210045|85; Termination: SMD/SMT; Tolerance: 1%; Voltage Rating: 50V; Voltage Rating (AC): 50V; Voltage Rating (DC): 50V; Width: 500µm; Working Voltage: 50V; ComponentLink1URL: https://datasheet.octopart.com:443/RC0402FR-076K8L-Yageo-datasheet-175887523.pdf?src-supplier=IHS; ComponentLink1Description: https://datasheet.octopart.com:443/RC0402FR-076K8L-Yageo-datasheet-175887523.pdf?src-supplier=IHS; ComponentLink2URL: https://datasheet.octopart.com:443/RC0402FR-076K8L-Yageo-datasheet-103092701.pdf?src-supplier=Upverter; ComponentLink2Description: https://datasheet.octopart.com:443/RC0402FR-076K8L-Yageo-datasheet-103092701.pdf?src-supplier=Upverter; ComponentLink3URL: https://datasheet.octopart.com:443/RC0402FR-076K8L-Yageo-datasheet-10408619.pdf?src-supplier=element14+APAC; ComponentLink3Description: https://datasheet.octopart.com:443/RC0402FR-076K8L-Yageo-datasheet-10408619.pdf?src-supplier=element14+APAC; ComponentLink4URL: https://datasheet.octopart.com:443/RC0402FR-076K8L-Yageo-datasheet-62067350.pdf?src-supplier=element14+APAC; ComponentLink4Description: https://datasheet.octopart.com:443/RC0402FR-076K8L-Yageo-datasheet-62067350.pdf?src-supplier=element14+APAC; ComponentLink5URL: https://datasheet.octopart.com:443/RC0402FR-076K8L-Yageo-datasheet-8324527.pdf?src-supplier=Newark; ComponentLink5Description: https://datasheet.octopart.com:443/RC0402FR-076K8L-Yageo-datasheet-8324527.pdf?src-supplier=Newark; ComponentLink6URL: https://datasheet.octopart.com:443/RC0402FR-076K8L-Yageo-Group-datasheet-189192902.pdf?src-supplier=LCSC; ComponentLink6Description: https://datasheet.octopart.com:443/RC0402FR-076K8L-Yageo-Group-datasheet-189192902.pdf?src-supplier=LCSC; ComponentLink7URL: https://datasheet.octopart.com:443/RC0402FR-076K8L-Yageo-Group-datasheet-176638170.pdf?src-supplier=Future+Electronics; ComponentLink7Description: https://datasheet.octopart.com:443/RC0402FR-076K8L-Yageo-Group-datasheet-176638170.pdf?src-supplier=Future+Electronics; ComponentLink8URL: https://datasheet.octopart.com:443/RC0402FR-076K8L-Yageo-datasheet-164759695.pdf?src-supplier=Future+Electronics; ComponentLink8Description: https://datasheet.octopart.com:443/RC0402FR-076K8L-Yageo-datasheet-164759695.pdf?src-supplier=Future+Electronics; ComponentLink9URL: https://datasheet.octopart.com:443/RC0402FR-076K8L-Yageo-datasheet-137700087.pdf?src-supplier=Future+Electronics; ComponentLink9Description: https://datasheet.octopart.com:443/RC0402FR-076K8L-Yageo-datasheet-137700087.pdf?src-supplier=Future+Electronics; ComponentLink10URL: https://datasheet.octopart.com:443/RC0402FR-076K8L-Yageo-datasheet-12531192.pdf?src-supplier=Future+Electronics; ComponentLink10Description: https://datasheet.octopart.com:443/RC0402FR-076K8L-Yageo-datasheet-12531192.pdf?src-supplier=Future+Electronics; ComponentLink11URL: https://datasheet.octopart.com:443/RC0402FR-076K8L-Yageo-datasheet-148775077.pdf?src-supplier=TME; ComponentLink11Description: https://datasheet.octopart.com:443/RC0402FR-076K8L-Yageo-datasheet-148775077.pdf?src-supplier=TME; ComponentLink12URL: https://datasheet.octopart.com/RC0402FR-076K8L-Yageo-datasheet-73766026.pdf; ComponentLink12Description: https://datasheet.octopart.com/RC0402FR-076K8L-Yageo-datasheet-73766026.pdf; ComponentLink13URL: http://sigma.octopart.com:80/conflict_mineral_statement/Yageo-company-3.pdf?src-supplier=Compliance+Statements; ComponentLink13Description: http://sigma.octopart.com:80/conflict_mineral_statement/Yageo-company-3.pdf?src-supplier=Compliance+Statements; ComponentLink14URL: http://sigma.octopart.com:80/rohs_statement/Yageo-company-2.pdf?src-supplier=Compliance+Statements; ComponentLink14Description: http://sigma.octopart.com:80/rohs_statement/Yageo-company-2.pdf?src-supplier=Compliance+Statements; Supplier 2: LCSC; Supplier Part Number 2: C93940